# Altium schematic sheet LAIKA Driver.SchDoc
size A3
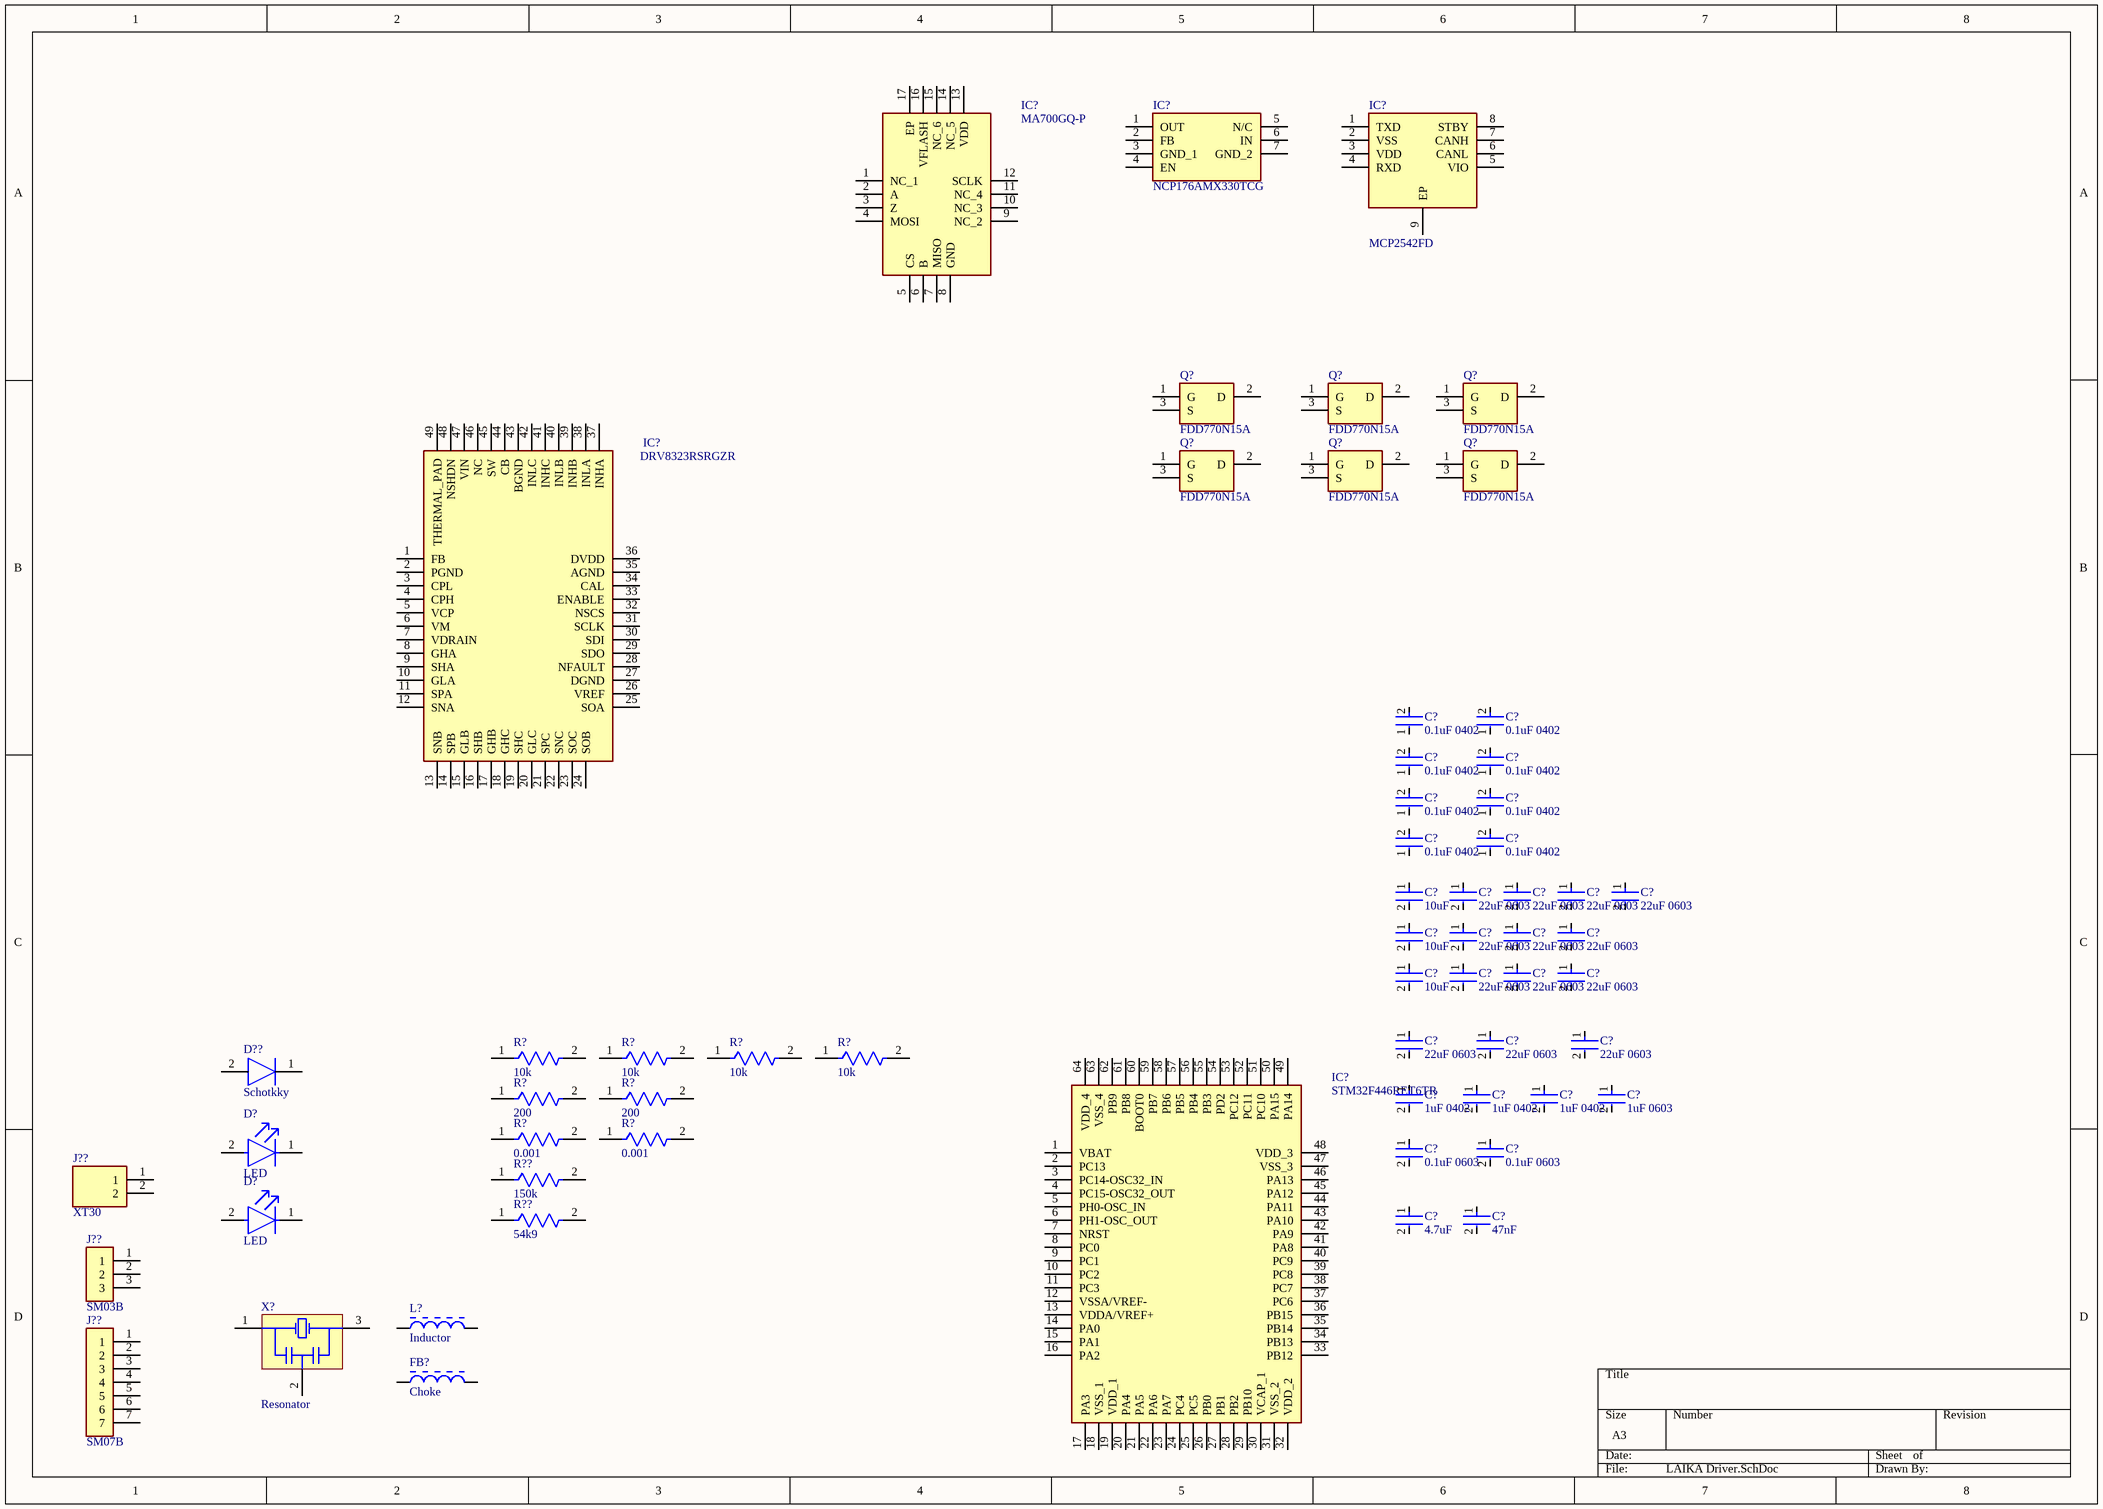
[diagram p0: LAIKA Driver.SchDoc]

## Parts
(Parts that share a designator on the sheet are numbered #1, #2 ... from top to bottom, then left to right.)
C?#1  0.1uF 0402  [FP-GRM15-MFG]
C?#2  0.1uF 0402  [FP-GRM15-MFG]
C?#3  0.1uF 0402  [FP-GRM15-MFG]
C?#4  0.1uF 0402  [FP-GRM15-MFG]
C?#5  0.1uF 0402  [FP-GRM15-MFG]
C?#6  0.1uF 0402  [FP-GRM15-MFG]
C?#7  0.1uF 0402  [FP-GRM15-MFG]
C?#8  0.1uF 0402  [FP-GRM15-MFG]
C?#9  10uF  [FP-CL31-IPC_C]
C?#10  22uF 0603  [FP-GRM188-0_2-IPC_C]
C?#11  22uF 0603  [FP-GRM188-0_2-IPC_C]
C?#12  22uF 0603  [FP-GRM188-0_2-IPC_C]
C?#13  22uF 0603  [FP-GRM188-0_2-IPC_C]
C?#14  10uF  [FP-CL31-IPC_C]
C?#15  22uF 0603  [FP-GRM188-0_2-IPC_C]
C?#16  22uF 0603  [FP-GRM188-0_2-IPC_C]
C?#17  22uF 0603  [FP-GRM188-0_2-IPC_C]
C?#18  10uF  [FP-CL31-IPC_C]
C?#19  22uF 0603  [FP-GRM188-0_2-IPC_C]
C?#20  22uF 0603  [FP-GRM188-0_2-IPC_C]
C?#21  22uF 0603  [FP-GRM188-0_2-IPC_C]
C?#22  22uF 0603  [FP-GRM188-0_2-IPC_C]
C?#23  22uF 0603  [FP-GRM188-0_2-IPC_C]
C?#24  22uF 0603  [FP-GRM188-0_2-IPC_C]
C?#25  1uF 0402  [FP-CL511-IPC_C]
C?#26  1uF 0402  [FP-CL511-IPC_C]
C?#27  1uF 0402  [FP-CL511-IPC_C]
C?#28  1uF 0603  [FP-CL10-IPC_C]
C?#29  0.1uF 0603  [FP-CL10-0_1-MFG]
C?#30  0.1uF 0603  [FP-CL10-0_1-MFG]
C?#31  4.7uF  [FP-CL283-IPC_C]
C?#32  47nF  [FP-CL841-IPC_C]
D?#1  LED  [FP-6_541-5056_01-4-MFG]
D?#2  LED  [FP-6_541-5056_01-4-MFG]
D??  Schotkky  [ONSC-SOD-123-2-425-04_V]
FB?  Choke  [MURA-BLM18-F-H1-CHIP-2_V]
IC?#1  NCP176AMX330TCG  [NCP176AMX330TCG]
IC?#2  MCP2542FD  [SON65P300X300X100-9N-D]
IC?#3  MA700GQ-P  [QFN50P300X300X100-17N-D]
IC?#4  DRV8323RSRGZR  [QFN50P700X700X100-49N-D]
IC?#5  STM32F446RET6TR  [QFP50P1200X1200X160-64N]
J??#1  XT30  [XT30PWM]
J??#2  SM03B  [SM03BSRSSTBLFSN]
J??#3  SM07B  [SM07B-SRSS-TB]
L?  Inductor  [BOUR-SDR0403-2_V]
Q?#1  FDD770N15A  [FDD770N15A]
Q?#2  FDD770N15A  [FDD770N15A]
Q?#3  FDD770N15A  [FDD770N15A]
Q?#4  FDD770N15A  [FDD770N15A]
Q?#5  FDD770N15A  [FDD770N15A]
Q?#6  FDD770N15A  [FDD770N15A]
R?#1  10k  [FP-CRCW0402-e3-IPC_B]
R?#2  10k  [FP-CRCW0402-e3-IPC_B]
R?#3  10k  [FP-CRCW0402-e3-IPC_B]
R?#4  10k  [FP-CRCW0402-e3-IPC_B]
R?#5  200  [FP-CRCW0402-e3-IPC_C]
R?#6  200  [FP-CRCW0402-e3-IPC_C]
R?#7  0.001  [FP-CRCW2512-e3-IPC_A]
R?#8  0.001  [FP-CRCW2512-e3-IPC_A]
R??#1  150k  [RESC1005X40X25NL05T05]
R??#2  54k9  [RESC1005X40X25LL05T10]
X?  Resonator  [MURA-CSTCE_G_A-3_V]

## Nets

Not connected (* = marked no-connect by the designer): C?#1 1 2; C?#2 1 2; C?#3 1 2; C?#4 1 2; C?#5 1 2; C?#6 1 2; C?#7 1 2; C?#8 1 2; C?#9 1 2; C?#10 1 2; C?#11 1 2; C?#12 1 2; C?#13 1 2; C?#14 1 2; C?#15 1 2; C?#16 1 2; C?#17 1 2; C?#18 1 2; C?#19 1 2; C?#20 1 2; C?#21 1 2; C?#22 1 2; C?#23 1 2; C?#24 1 2; C?#25 1 2; C?#26 1 2; C?#27 1 2; C?#28 1 2; C?#29 1 2; C?#30 1 2; C?#31 1 2; C?#32 1 2; D?#1 1(C) 2(A); D?#2 1(C) 2(A); D?? 1 2; FB? 1 2; IC?#1 1(OUT) 2(FB) 3(GND_1) 4(EN) 5(N/C) 6(IN) 7(GND_2); IC?#2 1(TXD) 2(VSS) 3(VDD) 4(RXD) 5(VIO) 6(CANL) 7(CANH) 8(STBY) 9(EP); IC?#3 1(NC_1) 2(A) 3(Z) 4(MOSI) 5(CS) 6(B) 7(MISO) 8(GND) 9(NC_2) 10(NC_3) 11(NC_4) 12(SCLK) 13(VDD) 14(NC_5) 15(NC_6) 16(VFLASH) 17(EP); IC?#4 1(FB) 2(PGND) 3(CPL) 4(CPH) 5(VCP) 6(VM) 7(VDRAIN) 8(GHA) 9(SHA) 10(GLA) 11(SPA) 12(SNA) 13(SNB) 14(SPB) 15(GLB) 16(SHB) 17(GHB) 18(GHC) 19(SHC) 20(GLC) 21(SPC) 22(SNC) 23(SOC) 24(SOB) 25(SOA) 26(VREF) 27(DGND) 28(NFAULT) 29(SDO) 30(SDI) 31(SCLK) 32(NSCS) 33(ENABLE) 34(CAL) 35(AGND) 36(DVDD) 37(INHA) 38(INLA) 39(INHB) 40(INLB) 41(INHC) 42(INLC) 43(BGND) 44(CB) 45(SW) 46(NC) 47(VIN) 48(NSHDN) 49(THERMAL_PAD); IC?#5 1(VBAT) 2(PC13) 3(PC14-OSC32_IN) 4(PC15-OSC32_OUT) 5(PH0-OSC_IN) 6(PH1-OSC_OUT) 7(NRST) 8(PC0) 9(PC1) 10(PC2) 11(PC3) 12(VSSA/VREF-) 13(VDDA/VREF+) 14(PA0) 15(PA1) 16(PA2) 17(PA3) 18(VSS_1) 19(VDD_1) 20(PA4) 21(PA5) 22(PA6) 23(PA7) 24(PC4) 25(PC5) 26(PB0) 27(PB1) 28(PB2) 29(PB10) 30(VCAP_1) 31(VSS_2) 32(VDD_2) 33(PB12) 34(PB13) 35(PB14) 36(PB15) 37(PC6) 38(PC7) 39(PC8) 40(PC9) 41(PA8) 42(PA9) 43(PA10) 44(PA11) 45(PA12) 46(PA13) 47(VSS_3) 48(VDD_3) 49(PA14) 50(PA15) 51(PC10) 52(PC11) 53(PC12) 54(PD2) 55(PB3) 56(PB4) 57(PB5) 58(PB6) 59(PB7) 60(BOOT0) 61(PB8) 62(PB9) 63(VSS_4) 64(VDD_4); J??#1 1 2; J??#2 1 2 3; J??#3 1 2 3 4 5 6 7; L? 1 2; Q?#1 1(G) 2(D) 3(S); Q?#2 1(G) 2(D) 3(S); Q?#3 1(G) 2(D) 3(S); Q?#4 1(G) 2(D) 3(S); Q?#5 1(G) 2(D) 3(S); Q?#6 1(G) 2(D) 3(S); R?#1 1 2; R?#2 1 2; R?#3 1 2; R?#4 1 2; R?#5 1 2; R?#6 1 2; R?#7 1 2; R?#8 1 2; R??#1 1 2; R??#2 1 2; X? 1(X1) 2(GND) 3(X2)

## Library data of the parts
C?#1-C?#8 = CMP-2100-03641-2: CAP CER 0.1UF 16V X7R 0402; Manufacturer Part Number: GRM155R71C104KA88D; Manufacturer: Murata; Standoff Height: 0mm; Tolerance: 10%; Voltage Rating: 16Vdc; Material: Ceramic; Capacitance: 0.10μF; Value: 0.10μF; RoHS: TRUE; Temperature Characteristic: X7R; Octopart: https://octopart.com/grm155r71c104ka88d-murata-196880; Digikey Description: CAP CER 0.1UF 16V X7R 0402; Device Class L3: Ceramic Capacitors; Height: 0.55mm; ComponentLink2Description: Datasheet; Temperature Range Low: -55°C; Ipc Land Pattern Name: CAPC10050X219; ComponentLink2URL: https://search.murata.co.jp/Ceramy/image/img/A01X/G101/ENG/GRM155R71H471KA01-01A.pdf; Device Class L1: Passive Components; Lead Free: yes; Category: Cap; Package: GRM15; Temperature: -55°C to +125°C; Device Class L2: Capacitors; Temperature Range High: +125°C; Mouser Description: 0402 0.1 uF 16V ±10 % Tolerance X7R SMT Multilayer Ceramic Capacitor
C?#9 C?#14 C?#18 = CMP-13271-000016-1: CAP CER 10UF 50V X5R 1206; Manufacturer: Samsung; Manufacturer Part Number: CL31A106KBHNNNE; Tolerance: 10%; Material: Ceramic; Temperature Coefficient: 15%; RoHS: TRUE; Ipc Land Pattern Name: CAPC320160X160; Temperature Range Low: -55°C; Value: 10uF; Device Class L3: Ceramic Capacitors; Category: Cap; Temperature Characteristic: X5R; Lead Free: Yes; Device Class L2: Capacitors; Octopart: https://octopart.com/cl31a106kbhnnne-samsung-19832778; ComponentLink2Description: Datasheet; Digikey Description: CAP CER 10UF 50V X5R 1206; Voltage: 50V; ComponentLink2URL: http://www.samsungsem.com/kr/support/product-search/mlcc/__icsFiles/afieldfile/2018/06/21/CL31A106KBHNNNE.pdf; Capacitance: 10uF; Temperature Range High: +85°C; Device Class L1: Passive Components; Height: 1.8mm; Automotive: No; Voltage Rating: 50V; Package: CL31; Temperature: -55°C to +85°C
C?#10-C?#13 C?#15-C?#17 C?#19-C?#24 = CMP-2000-06337-3: Chip Multilayer Ceramic Capacitors for General Purpose, 0603, 22uF, X5R, 15%, 20%, 10V; Tolerance: 20%; Weight: 0.000222oz; Material: Ceramic; Depth: 0.8mm; Length: 1.6mm; Termination: SMD/SMT; Capacitance: 22uF; Packaging: Tape and Reel; Width: 0.8mm; Voltage Rating: 10V; Case Code (Imperial): 0603; Mount: Surface Mount; Voltage Rating (DC): 10V; Case/Package: 0603; Thickness: 0.039inch; REACH SVHC: No SVHC; Dielectric: X5R; Height: 0.8mm; Package Quantity: 4000; Case Code (Metric): 1608; Min Operating Temperature: -55°C; Lead Free: Lead Free; Max Operating Temperature: 85°C
C?#25-C?#27 = CMP-13271-001936-1: Cap Ceramic 1uF 10V X5R ±10% SMD 0402 +85°C Paper T/R; Depth: 0.5mm; Case Code (Imperial): 0402; Material: Ceramic; Mount: Surface Mount; Thickness: 0.022inch; Dielectric: X5R; Capacitance: 1uF; Radiation Hardening: No; Case/Package: 0402; Length: 1mm; Tolerance: 10%; Max Operating Temperature: 85°C; Package Quantity: 1; Width: 0.02inch; Voltage Rating: 10V; Contact Plating: Tin; Height: 0.5mm; Min Operating Temperature: -55°C; Case Code (Metric): 1005; Packaging: Tape and Reel
C?#28 = CMP-13271-003017-1: Cap Ceramic 1uF 10V X5R ±10% Pad SMD 0603 +85°C T/R; Capacitance: 4.7uF; Case/Package: 0603; Packaging: Tape and Reel; Width: 0.031inch; Contact Plating: Tin; Thickness: 0.035inch; Package Quantity: 1; Voltage Rating: 10V; Case Code (Metric): 1608; Case Code (Imperial): 0603; Depth: 0.8mm; Height: 0.8mm; Tolerance: 10%; Max Operating Temperature: 85°C; Length: 1.6mm; Dielectric: X5R; Mount: Surface Mount; Radiation Hardening: No; Min Operating Temperature: -55°C
C?#29 C?#30 = CMP-13271-000011-1: CAP CER 0.1UF 50V X7R 0603; Manufacturer: Samsung Electro-Mechanics America, Inc; Manufacturer Part Number: CL10B104JB8NNNC; Value: 100nF; Material: Ceramic; Temperature Coefficient: 15%; Tolerance: 5%; Ipc Land Pattern Name: CAPC16080X80; Device Class L1: Passive Components; Digikey Description: CAP CER 0.1UF 50V X7R 0603; Voltage Rating: 50V; Height: 0.9mm; ComponentLink2Description: Datasheet; Device Class L2: Capacitors; ComponentLink2URL: http://www.samsungsem.com/kr/support/product-search/mlcc/__icsFiles/afieldfile/2019/06/18/CL10B104JB8NNNC-19.pdf; Temperature Characteristic: X7R; Temperature Range High: +125°C; Lead Free: Yes; Temperature Range Low: -55°C; Category: Cap; Package: CL10-0.1; Temperature: -55°C to +125°C; Octopart: https://octopart.com/cl10b104jb8nnnc-samsung-9302151; Device Class L3: Ceramic Capacitors; RoHS: TRUE; Automotive: No; Capacitance: 100nF
C?#31 = CMP-13271-003018-1: Cap Ceramic 4.7uF 6.3V X5R ±20% SMD 0402 +85°C Paper T/R; Lead Free: Lead Free; Voltage Rating: 6.3V; Case Code (Metric): 1005; Package Quantity: 1; Capacitance: 4.7uF; Length: 0.039inch; Mount: Surface Mount; Radiation Hardening: No; Packaging: Tape and Reel; Tolerance: 20%; Max Operating Temperature: 85°C; Width: 0.02inch; Case Code (Imperial): 0402; Thickness: 0.022inch; Min Operating Temperature: -55°C; Dielectric: X5R; Case/Package: 0402; Depth: 0.5mm
C?#32 = CMP-13271-002097-1: Cap Ceramic 47nF 50V X7R ±10% SMD 0402 +125°C Paper T/R
D?#1 D?#2 = CMP-02520-000009-1: LED GREEN 0603 SMD; Manufacturer Part Number: TLMP1100-GS08; Manufacturer: Vishay; Max Junction Temp: +120°C; Automotive Grade: Grade 3; Reverse Voltage: 6V; Led Orientation: Top View; Forward Voltage: 2.1V; Luminous Intensity: 15mcd; Forward Current: 20mA; Colour: Pure green; Peak Emmision Wavelength: 562nm; Wavelength: 561nm; Viewing Angle: 160°; Power Dissipation: 90mW; Digikey Description: LED GREEN 0603 SMD; Package: 6.541-5056.01-4; Ambient Temperature Range High: +100°C; Height: 0.65mm; Device Class L1: Optoelectronics; Device Class L2: LEDs; Mouser Description: Standard LEDs - SMD Pure Green; Temperature Range High: +120°C; RoHS: TRUE; Ambient Temperature Range Low: -40°C; Temperature: to +120°C; ComponentLink2URL: http://www.vishay.com/docs/83173/tlmb1100.pdf; Lead Free: Yes; Octopart: https://octopart.com/tlmp1100-gs08-vishay-55433993; Automotive: Yes; Device Class L3: unset; ComponentLink2Description: Datasheet; Category: Diode
D?? = CMP-1055-00423-1: Schottky Power Rectifier, 2-Pin SOD-123, Pb-Free, Tape and Reel; PartNumber: MBR130T1G; Manufacturer: ON Semiconductor; IFSM Max (A): 5.5; Configuration: Single; Mounting Technology: Surface Mount; ComponentLink3Description: Package Specification; PackageDescription: 2-Pin SOD, Body 1.6 x 2.69 mm; ComponentLink2Description: Datasheet; ComponentLink1Description: Manufacturer URL; Packing: Tape and Reel; PackageVersion: Rev. G, 10/2009; DatasheetVersion: Rev. 4; ComponentLink1URL: http://www.onsemi.com/; ComponentLink2URL: http://www.onsemi.cn/pub_link/Collateral/MBR130T1-D.PDF; PackageReference: SOD-123-2-425-04; ComponentLink3URL: http://www.onsemi.com/pub_link/Collateral/425-04.PDF; RoHS: TRUE; Manufacturer Part Number: MBR130T1G
FB? = CMP-0686-00436-2: Chip Ferrite Bead for General Use, 600 Ohm, 500 mA, -55 to 125 degC, 1.6 x 0.8 x 0.95 mm SMD, Tape and Reel; Manufacturer: Murata; PartNumber: BLM18AG601SN1D; DC Resistance: 0.38 Ohm Max.; Impedance (at 100 MHz): 600 Ohm +/- 25%; Rated Current: 500 mA; ComponentLink3Description: Package Specification; ComponentLink1Description: Manufacturer URL; ComponentLink1URL: http://www.murata.com/; DatasheetVersion: 08/2013; ComponentLink2URL: http://www.murata.com/products/catalog/pdf/c31e.pdf; PackageReference: BLM18_H950-2; PackageDescription: 2-Pin Chip, Body 1.6 x 0.8 mm; Mounting Technology: Surface Mount; ComponentLink2Description: Datasheet; Packing: Tape and Reel; ComponentLink3URL: http://www.murata.com/products/catalog/pdf/c31e.pdf; Operating Temperature Range: -55 to 125 degC
IC?#1 = NCP176AMX330TCG: Integrated Circuit; Manufacturer_Name: ON Semiconductor; Datasheet Link: https://www.mouser.com/datasheet/2/308/NCP176-D-1551588.pdf; Height: 0.45mm; Manufacturer_Part_Number: NCP176AMX330TCG; Arrow Part Number: NCP176AMX330TCG; Arrow Price/Stock: https://www.arrow.com/en/products/ncp176amx330tcg/on-semiconductor; Mouser Part Number: 863-NCP176AMX330TCG; Mouser Price/Stock: https://www.mouser.com/Search/Refine.aspx?Keyword=863-NCP176AMX330TCG
IC?#2 = MCP2542FD-E_MF: Integrated Circuit; Manufacturer_Name: Microchip; Manufacturer_Part_Number: MCP2542FD-E/MF; Datasheet Link: http://ww1.microchip.com/downloads/en/devicedoc/20005514a.pdf; Height: 1mm; Arrow Part Number: MCP2542FD-E/MF; Arrow Price/Stock: https://www.arrow.com/en/products/mcp2542fd-emf/microchip-technology; Mouser Part Number: 579-MCP2542FD-E/MF; Mouser Price/Stock: https://www.mouser.co.uk/ProductDetail/Microchip-Technology/MCP2542FD-E-MF?qs=l7cgNqFNU1jog4BwTzULBw%3D%3D
IC?#3 = MA700GQ-P: Integrated Circuit; Manufacturer_Name: Monolithic Power Systems (MPS); Datasheet Link: http://www.mouser.com/datasheet/2/277/datasheet_MA700_rev1.2-1101466.pdf; Height: 1mm; Manufacturer_Part_Number: MA700GQ-P; Mouser Part Number: 946-MA700GQ-P; Mouser Price/Stock: https://www.mouser.co.uk/ProductDetail/Monolithic-Power-Systems-MPS/MA700GQ-P?qs=CjgjetG5vV6%2FCTYmekMVTA%3D%3D
IC?#4 = DRV8323RSRGZR: Integrated Circuit; Manufacturer_Name: Texas Instruments; Datasheet Link: http://www.ti.com/lit/gpn/drv8323r; Height: 1mm; Manufacturer_Part_Number: DRV8323RSRGZR; Arrow Part Number: DRV8323RSRGZR; Arrow Price/Stock: https://www.arrow.com/en/products/drv8323rsrgzr/texas-instruments; Mouser Part Number: 595-DRV8323RSRGZR; Mouser Price/Stock: https://www.mouser.co.uk/ProductDetail/Texas-Instruments/DRV8323RSRGZR?qs=Mv7BduZupUiaPRwy%2F9hIqw%3D%3D
IC?#5 = STM32F446RET6TR: Integrated Circuit; Manufacturer_Name: STMicroelectronics; Datasheet Link: https://www.arrow.com/en/products/stm32f446ret6tr/stmicroelectronics; Height: 1.6mm; Manufacturer_Part_Number: STM32F446RET6TR; Arrow Part Number: STM32F446RET6TR; Arrow Price/Stock: https://www.arrow.com/en/products/stm32f446ret6tr/stmicroelectronics; Mouser Part Number: 511-STM32F446RET6TR; Mouser Price/Stock: https://www.mouser.co.uk/ProductDetail/STMicroelectronics/STM32F446RET6TR?qs=xZ%2FP%252Ba9zWqYaBJrnMqQZtg%3D%3D
J??#1 = XT30PW-M: Connector; Manufacturer_Name: Amass; Datasheet Link: https://www.tme.eu/sl/Document/ce4077e36b79046da520ca73227e15de/XT30PW%20SPEC.pdf; Height: 5mm; Manufacturer_Part_Number: XT30PW-M
J??#2 = SM03B-SRSS-TB_LF__SN_: Connector; Manufacturer_Name: JST Sales America; Manufacturer_Part_Number: SM03B-SRSS-TB(LF)(SN); Datasheet Link: http://www.jst-mfg.com/product/pdf/eng/eSR.pdf; Height: 2.9mm
J??#3 = SM07B-SRSS-TB__LF__SN_: Connector; Manufacturer_Name: JST (JAPAN SOLDERLESS TERMINALS); Manufacturer_Part_Number: SM07B-SRSS-TB (LF)(SN); Datasheet Link: http://uk.rs-online.com/web/p/products/5468833; Arrow Part Number: SM07B-SRSS-TB (LF)(SN); Arrow Price/Stock: https://www.arrow.com/en/products/sm07b-srss-tb-lf-sn/jst-manufacturing
L? = CMP-0904-00006-1: SDR0403 Series Power Inductor, 22 uF +/- 20 %, 0.38 Ohm, -40 to 125 degC, 2-Pin SMD, RoHS, Tape and Reel; Manufacturer: Bourns; PartNumber: SDR0403-220ML; Inductance (uH): 22; SRF (MHz): 20 Min.; RDC (Ohm): 0.38 Max.; Test Frequency (MHz): 2.52; Tolerance (%): +/- 20; I sat (A): 1.2 Typ.; Q: 25; I rms (A): 0.76 Max.; ComponentLink2URL: http://www.bourns.com/data/global/pdfs/sdr0403.pdf; Temperature Range: -40 to 125 degC; ComponentLink2Description: Datasheet; ComponentLink1URL: http://www.bourns.com/; RoHS: TRUE; PackageReference: SDR0403-2; PackageDescription: 3-Pin SMD, Dia 4.5 mm, Height 3.5 mm; DatasheetVersion: Feb-12; Mounting Technology: Surface Mount; Packing: Tape and Reel; ComponentLink1Description: Manufacturer URL
Q?#1-Q?#6 = FDD770N15A: Transistor; Manufacturer_Name: ON Semiconductor; Datasheet Link: https://componentsearchengine.com/Datasheets/2/FDD770N15A.pdf; Height: 2.39mm; Manufacturer_Part_Number: FDD770N15A
R?#1-R?#4 = CMP-2002-08135-2: RES SMD 10K OHM 1% 1/16W 0402; Power Rating: 63mW; Resistance: 10kR; Voltage Rating: 50V; Temperature Coefficient: 100ppm/°C; Case Code (Metric): 1005; Features: Automotive AEC-Q200; Termination: SMD/SMT; Mount: Surface Mount; Package Quantity: 10; Packaging: Tape and Reel; Case Code (Imperial): 0402; Weight: 2.3E-05oz; Lead Free: Lead Free; Width: 0.02inch; Max Power Dissipation: 63mW; Tolerance: 1%; Number of Terminations: 2; Height: 0.35mm; Number of Pins: 2; Composition: Thick Film; Length: 1mm; Voltage Rating (DC): 50V; Case/Package: 0402; Radiation Hardening: No; Contact Plating: Tin; Depth: 0.5mm; Military Standard: Not; Min Operating Temperature: -55°C; Max Operating Temperature: 155°C
R?#5 R?#6 = CMP-1011-00429-3: RES Thick Film, 200Ω, 1%, 0.063W, 100ppm/°C, 0402; Max Power Dissipation: 63mW; Voltage Rating: 50V; Resistance: 200R; Termination: SMD/SMT; Weight: 2.3E-05oz; Case/Package: 0402; Contact Plating: Tin; Number of Pins: 2; Width: 0.5mm; Height: 0.35mm; Case Code (Metric): 1005; Military Standard: Not; Features: Automotive AEC-Q200; Power Rating: 63mW; Temperature Coefficient: 100ppm/°C; Tolerance: 1%; Lead Free: Lead Free; Depth: 0.5mm; Max Operating Temperature: 155°C; Min Operating Temperature: -55°C; Package Quantity: 10; Voltage Rating (DC): 50V; Composition: Thick Film; Mount: Surface Mount; Radiation Hardening: No; Length: 1mm; Packaging: Tape and Reel; Number of Terminations: 2; Case Code (Imperial): 0402
R?#7 R?#8 = CMP-02407-002524-1: RES Thick Film, 10Ω, 5%, 1W, 200ppm/°C, 2512; Voltage Rating (DC): 500V; Resistance: 10R; Case/Package: 2512; Min Operating Temperature: -55°C; Number of Pins: 2; Lead Free: Lead Free; Radiation Hardening: No; Composition: Thick Film; Mount: Surface Mount; Package Quantity: 1; Case Code (Imperial): 2512; Voltage Rating: 500V; Termination: SMD/SMT; Length: 6.3mm; Number of Terminations: 2; Packaging: Tape and Reel; Temperature Coefficient: 200ppm/°C; Height: 0.028inch; Tolerance: 5%; Features: Automotive AEC-Q200; Case Code (Metric): 6432; Power Rating: 1W; Weight: 0.001429oz; Max Operating Temperature: 155°C; Depth: 3.15mm; Max Power Dissipation: 1W; Military Standard: Not; Width: 0.124inch; Contact Plating: Tin
R??#1 = CMP-2002-08212-1: Manufacturer: Vishay Dale; Part Number: CRCW0402150KFKED; Manufacturer: Vishay; Manufacturer Part Number: CRCW0402150KFKED
R??#2 = CMP-2002-07133-1: Part Number: RC0402FR-0754K9L; Manufacturer: Yageo; Manufacturer Part Number: RC0402FR-0754K9L
X? = CMP-2100-03620-1: Ceramic Resonator, 8 MHz, +/- 0.5%, -20 to 80 degC, 3-Pin SMD, RoHS, Tape and Reel; Manufacturer: Murata; Capacitance: 33pF; Frequency Stability: 0.2%; Self Resonant Frequency: 8MHz; Datasheet Version: 42339.0; RoHSCompliant: True; Datasheet URL: http://www.murata.com/~/media/webrenewal/support/library/catalog/products/timingdevice/ceralock/p16e.ashx; Case/Package: Ceramic; Load Capacitance: 33pF; Tolerance: 0.5%; Mount: SurfaceMount; Height: 0.031inch; Number of Pins: 3; Package Description: 3-Pin Surface Mount Device, Body 3.2 x 1.3 mm, Pitch 1.2 mm; Package Quantity: 1; Lead Free: LeadFree; Contact Plating: Gold; REACH SVHC: NoSVHC; Length: 0.126inch; Width: 0.051inch; Manufacturer URL: http://www.murata.com/; Packaging: TapeandReel; Termination: SMD/SMT; Frequency Tolerance: 0.5%; Max Operating Temperature: 80degC; Composition: Ceramic; Package Reference: CSTCE_G_A-3; Min Operating Temperature: -20degC; Frequency: 8MHz